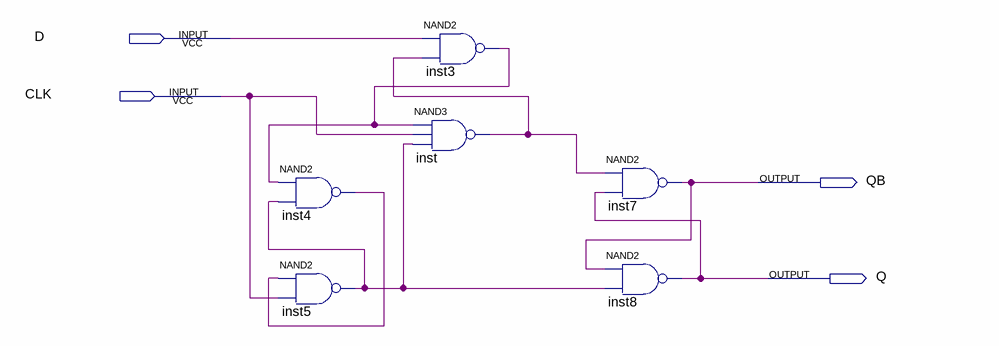
[diagram p0: schematic sheet]
// Quartus schematic figura5exp8.bdf as structural Verilog: 6 symbols, 4 pins
module figura5exp8 (
  input  D,
  input  CLK,
  output QB,
  output Q
);

  wire inst3_out, inst4_out, inst5_out, inst_out;

  nand inst4 (inst4_out, inst3_out, inst5_out);
  nand inst5 (inst5_out, inst4_out, CLK);
  nand inst3 (inst3_out, D, inst_out);
  nand inst (inst_out, inst3_out, CLK, inst5_out);
  nand inst7 (QB, inst_out, Q);
  nand inst8 (Q, QB, inst5_out);
endmodule
